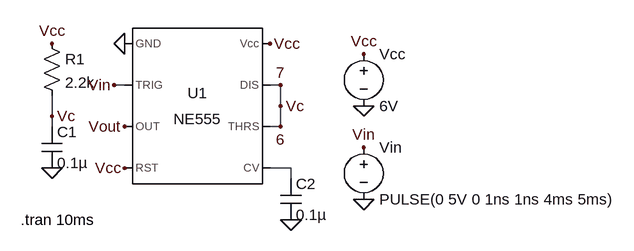
[diagram p0: schematic Monostable_Multivibrator_with_NE555.asc]
Monostable_Multivibrator_with_NE555.asc, the LTspice schematic file:
Version 4.1
SHEET 1 948 680
WIRE 176 144 160 144
WIRE 416 144 400 144
WIRE 416 176 416 144
WIRE 64 192 64 160
WIRE 64 208 64 192
WIRE 416 208 416 176
WIRE 416 208 400 208
WIRE 432 272 400 272
WIRE 432 288 432 272
FLAG 176 80 0
FLAG 64 272 0
FLAG 160 144 Vin
FLAG 176 208 Vout
FLAG 176 272 Vcc
FLAG 416 208 6
FLAG 416 144 7
FLAG 544 176 0
FLAG 544 96 Vcc
FLAG 400 80 Vcc
FLAG 64 80 Vcc
FLAG 64 192 Vc
FLAG 544 320 0
FLAG 544 240 Vin
FLAG 416 176 Vc
FLAG 432 352 0
SYMBOL cap 48 208 R0
SYMATTR InstName C1
SYMATTR Value 0.1µ
SYMBOL res 48 64 R0
SYMATTR InstName R1
SYMATTR Value 2.2k
SYMBOL Misc\\NE555 288 176 R0
SYMATTR InstName U1
SYMBOL voltage 544 80 R0
WINDOW 123 0 0 Left 0
WINDOW 39 0 0 Left 0
SYMATTR InstName Vcc
SYMATTR Value 6V
SYMBOL voltage 544 224 R0
WINDOW 123 0 0 Left 0
WINDOW 39 0 0 Left 0
SYMATTR InstName Vin
SYMATTR Value PULSE(0 5V 0 1ns 1ns 4ms 5ms)
SYMBOL cap 416 288 R0
SYMATTR InstName C2
SYMATTR Value 0.1µ
TEXT 16 352 Left 2 !.tran 10ms

The netlist it stands for:
* Monostable_Multivibrator_with_NE555.asc
C1 Vc 0 0.1µ
R1 Vcc Vc 2.2k
X§U1 0 Vin Vout Vcc N001 Vc Vc Vcc NE555  ; pins GND TRIG OUT RST CV THRS DIS Vcc
Vcc Vcc 0 6V
Vin Vin 0 PULSE(0 5V 0 1ns 1ns 4ms 5ms)
C2 N001 0 0.1µ
.tran 10ms
.lib NE555.sub
.backanno
.end